# Altium project nRF52832_NanoDevKit.PrjPcb
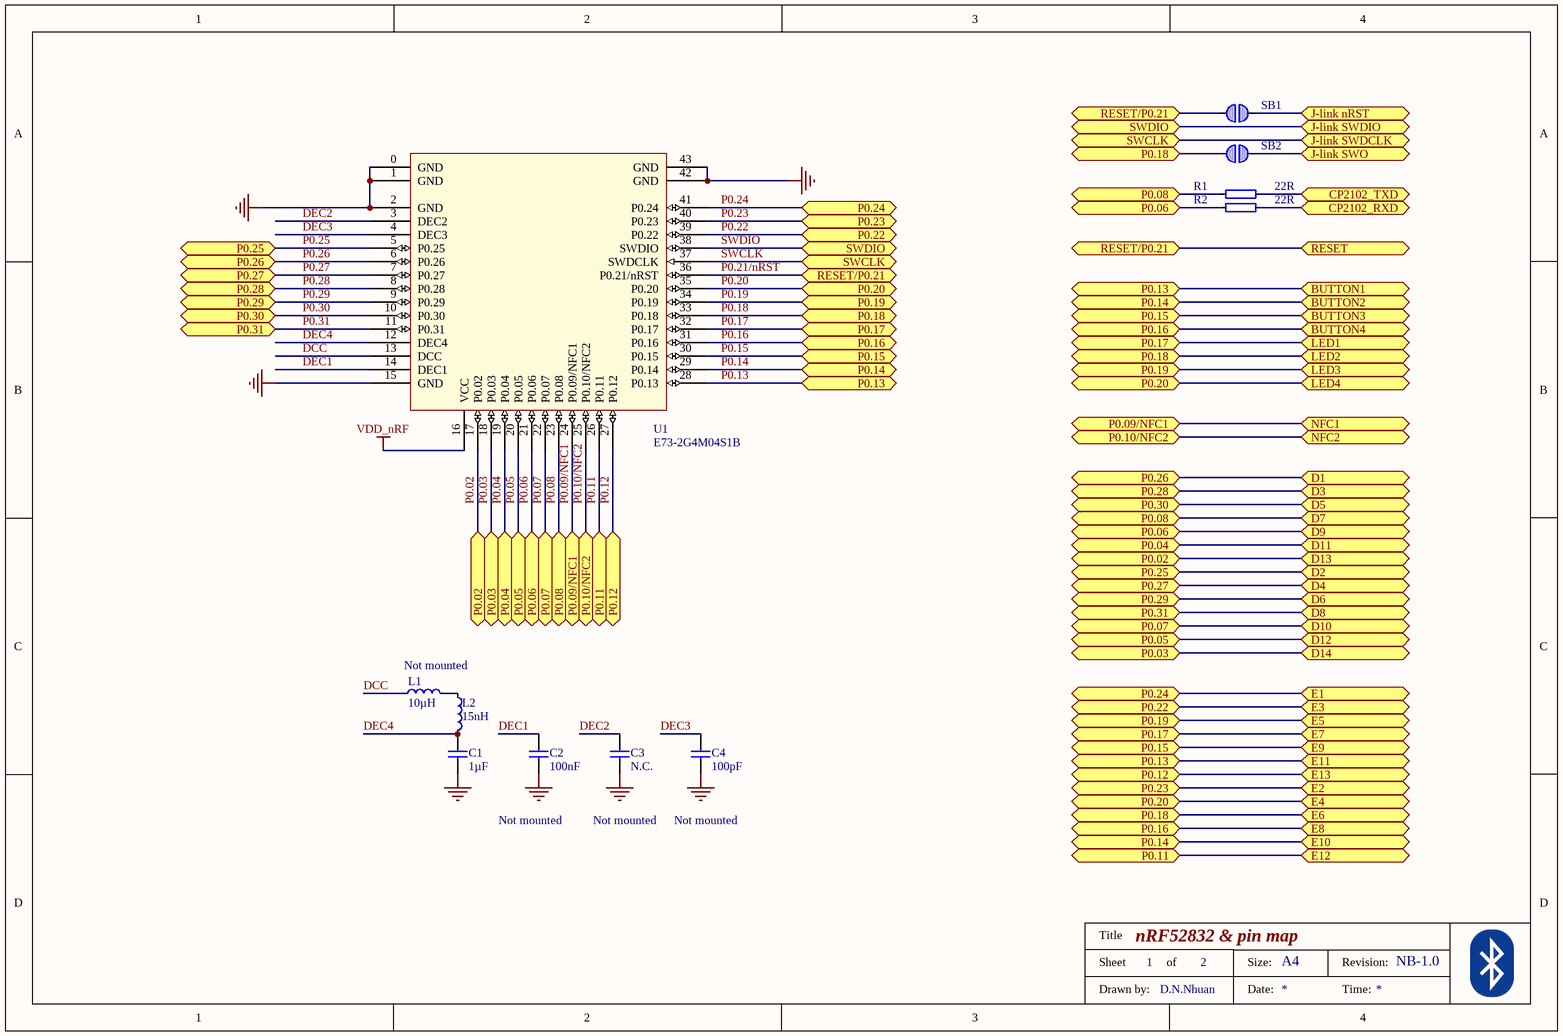
[diagram p0: nRF52832&pin_map.SchDoc]
2 sheets, 54 parts. Net scope: flat (ports and power ports of the same name join across sheets).
Board file: nRF52832_NanoDevKit.PcbDoc
Sheets:
  nRF52832&pin_map.SchDoc
  misc.SchDoc

## Sheet nRF52832&pin_map.SchDoc: nRF52832 & pin map
size A4; DrawnBy: D.N.Nhuan; DocumentNumber: 1; Revision: NB-1.0; SheetNumber: 1; SheetTotal: 2

### Parts
C1  1µF  [0603_Imperial]
C2  100nF  [0402 imperial]
C3  N.C.  [0402 imperial]
C4  100pF  [0402 imperial]
L1  10µH  [0603_Imperial]
L2  15nH  [0402 imperial]
R1  22R  [0402 imperial]
R2  22R  [0402 imperial]
SB1  Solderbridge  [Solderbridge]  (value not drawn)  (no BOM)
SB2  Solderbridge  [Solderbridge]  (value not drawn)  (no BOM)
U1  E73-2G4M04S1B  [nRF52832-Ebyte]

### Ports
BUTTON1, BUTTON2, BUTTON3, BUTTON4, CP2102_RXD, CP2102_TXD, D1, D2, D3, D4, D5, D6, D7, D8, D9, D10, D11, D12, D13, D14, E1, E2, E3, E4, E5, E6, E7, E8, E9, E10, E11, E12, E13, J-link nRST, J-link SWDCLK, J-link SWDIO, J-link SWO, LED1, LED2, LED3, LED4, NFC1, NFC2, P0.02, P0.03, P0.04, P0.05, P0.06, P0.07, P0.08, P0.09/NFC1, P0.10/NFC2, P0.11, P0.12, P0.13, P0.14, P0.15, P0.16, P0.17, P0.18, P0.19, P0.20, P0.22, P0.23, P0.24, P0.25, P0.26, P0.27, P0.28, P0.29, P0.30, P0.31, RESET, RESET/P0.21, SWCLK, SWDIO

### Nets
GND: C1.1 C2.1 C3.1 C4.1 U1.0(GND) U1.1(GND) U1.2(GND) U1.15(GND) U1.42(GND) U1.43(GND)
VDD_nRF: U1.16(VCC)
CP2102RXD: R2.2 ; port CP2102_RXD
CP2102TXD: R1.2 ; port CP2102_TXD
DCC: L1.1 U1.13(DCC)
DEC1: C2.2 U1.14(DEC1)
DEC2: C3.2 U1.3(DEC2)
DEC3: C4.2 U1.4(DEC3)
DEC4: C1.2 L2.2 U1.12(DEC4)
J-link nRST: SB1.1 ; port J-link nRST
J-link SWO: SB2.1 ; port J-link SWO
P0.02: U1.17(P0.02) ; port P0.02, port D13
P0.03: U1.18(P0.03) ; port P0.03, port D14
P0.04: U1.19(P0.04) ; port P0.04, port D11
P0.05: U1.20(P0.05) ; port P0.05, port D12
P0.06: R2.1 U1.21(P0.06) ; port P0.06, port D9
P0.07: U1.22(P0.07) ; port P0.07, port D10
P0.08: R1.1 U1.23(P0.08) ; port P0.08, port D7
P0.09/NFC1: U1.24(P0.09/NFC1) ; port P0.09/NFC1, port NFC1
P0.10/NFC2: U1.25(P0.10/NFC2) ; port P0.10/NFC2, port NFC2
P0.11: U1.26(P0.11) ; port E12, port P0.11
P0.12: U1.27(P0.12) ; port E13, port P0.12
P0.13: U1.28(P0.13) ; port P0.13, port BUTTON1, port E11
P0.14: U1.29(P0.14) ; port P0.14, port BUTTON2, port E10
P0.15: U1.30(P0.15) ; port P0.15, port BUTTON3, port E9
P0.16: U1.31(P0.16) ; port P0.16, port BUTTON4, port E8
P0.17: U1.32(P0.17) ; port P0.17, port LED1, port E7
P0.18: SB2.2 U1.33(P0.18) ; port P0.18, port LED2, port E6
P0.19: U1.34(P0.19) ; port P0.19, port LED3, port E5
P0.20: U1.35(P0.20) ; port P0.20, port LED4, port E4
P0.21/nRST: SB1.2 U1.36(P0.21/nRST) ; port RESET/P0.21, port RESET
P0.22: U1.39(P0.22) ; port P0.22, port E3
P0.23: U1.40(P0.23) ; port P0.23, port E2
P0.24: U1.41(P0.24) ; port P0.24, port E1
P0.25: U1.5(P0.25) ; port P0.25, port D2
P0.26: U1.6(P0.26) ; port P0.26, port D1
P0.27: U1.7(P0.27) ; port P0.27, port D4
P0.28: U1.8(P0.28) ; port P0.28, port D3
P0.29: U1.9(P0.29) ; port P0.29, port D6
P0.30: U1.10(P0.30) ; port P0.30, port D5
P0.31: U1.11(P0.31) ; port P0.31, port D8
SWCLK: U1.37(SWDCLK) ; port SWCLK, port J-link SWDCLK  [project net J-link SWCLK]
SWDIO: U1.38(SWDIO) ; port SWDIO, port J-link SWDIO  [project net J-link SWDIO]
NetL1_2: L1.2 L2.1

### Notes on the sheet
- Not mounted
- Title
- Sheet
- of
- Size:
- A4
- Revision:
- Drawn by:
- Date:
- Time:

### Library data of the parts
C1-C4 = Capacitor: common library; Tolerance: ±5%; Suppiler: *; Link of Supplier: *; Manufacturer: *; Manufacturer Part Number: *; Footprint: 0402
  C1: Value: 1µF
  C2: Value: 100nF
  C3: Value: N.C.
  C4: Value: 100pF
L1 L2 = Inductor: common library; Supplier: *; Link of Supplier: *; Maximum Current: *; Footprint: 0402
  L1: Value: 10µH
  L2: Value: 15nH
R1 R2 = Resistor: common library; Tolerance: ±5%; Value: 22R; Supplier: *; Link of Supplier: *; Footprint: 0402
SB1 SB2 = Solderbridge: Artikkelnr Noca: N.A.; Part Number: Solderbridge; Manufacturer: *; Manufacturer Part Number: *; Datasheet: *; LatestRevisionDate: 2009-12-14; Pin Count: 2; Publisher: Nordic Semiconductor; Published: 2009-12-14; Value: Solderbridge; Note: *; Supplier: *; Supplier part number: *; 2nd source Supplier: *; 2nd source part number: *; Footprint Doc: Solderbridge; Artikkelnr Simpro: N.A.
U1 = nRF52832-Ebyte: Ebyte E73-2G4M04S-52832; Part Number: E73-2G4M04S1B; Type: nRF52832 module; Manufacturer: EBYTE

## Sheet misc.SchDoc: Miscellaneous
size A4; DrawnBy: D.N.Nhuan; DocumentNumber: 2; Revision: NB-1.0; SheetNumber: 2; SheetTotal: 2
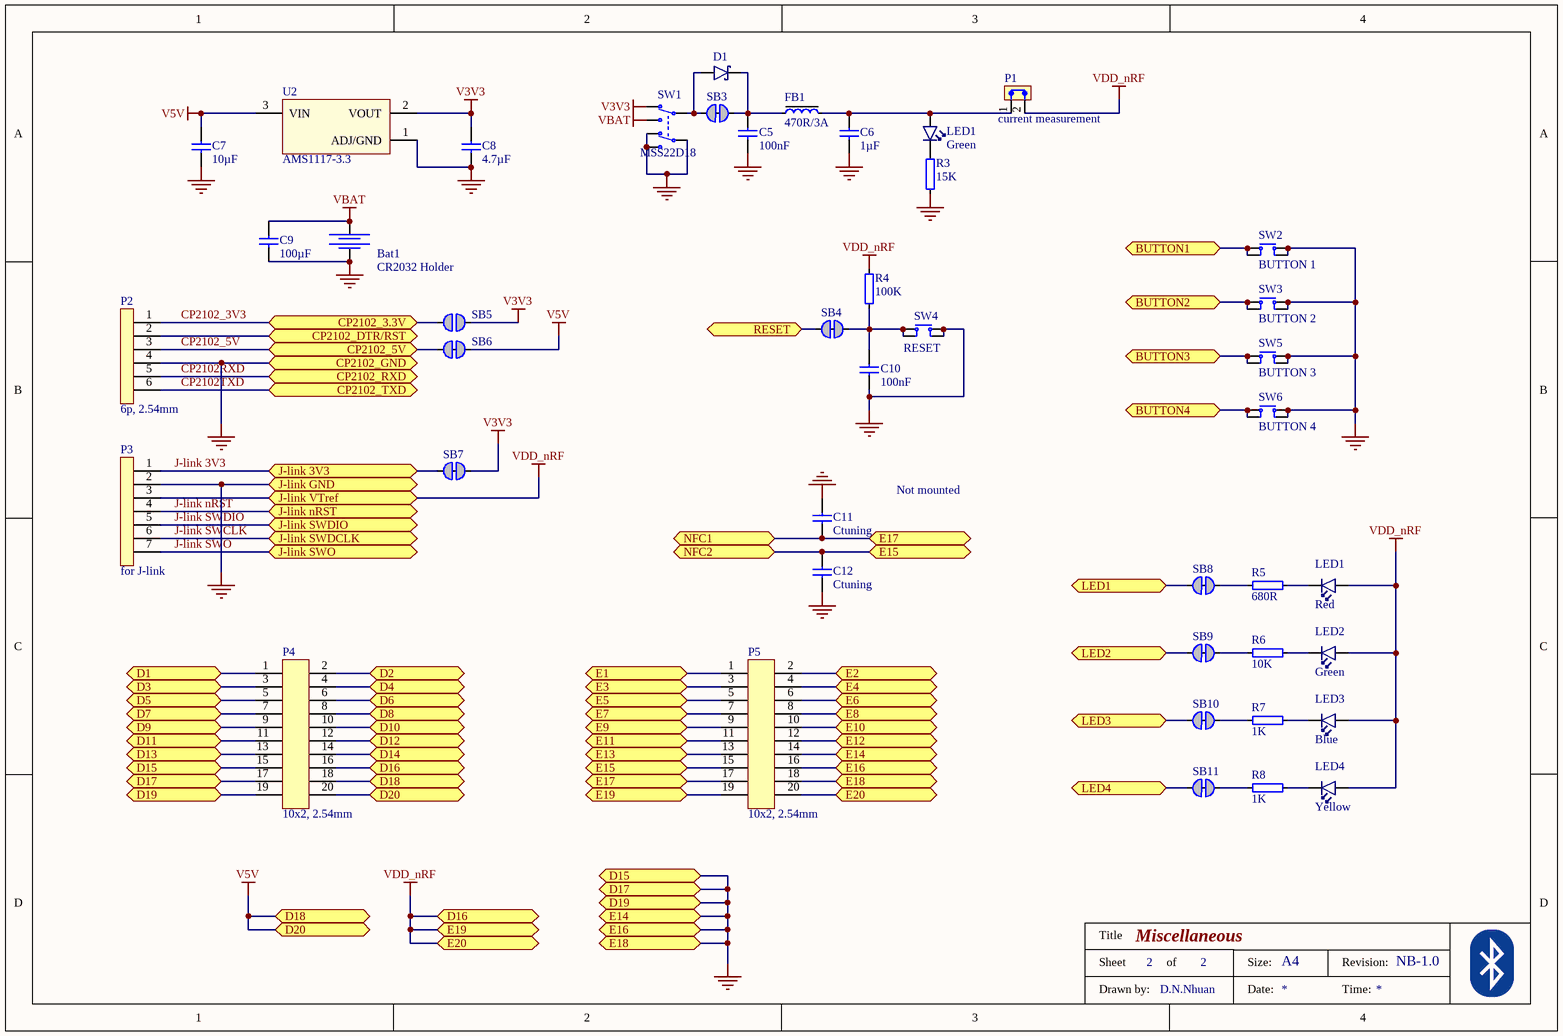
[diagram p1: misc.SchDoc]

### Parts
Bat1  CR2032 Holder  [CR2032_HOLDER]
C5  100nF  [0402 imperial]
C6  1µF  [0603_Imperial]
C7  10µF  [0805_Imperial]
C8  4.7µF  [0603_Imperial]
C9  100µF  [1210_Imperial]
C10  100nF  [0402 imperial]
C11  Ctuning  [0402 imperial]
C12  Ctuning  [0402 imperial]
D1  DIODE S4  [SOD-123]  (value not drawn)
FB1  470R/3A  [0603_Imperial]
LED1  Green  [LED_0603]
LED2  LED1  Color: Red  [LED_0603]
LED3  LED2  Color: Green  [LED_0603]
LED4  LED3  Color: Blue  [LED_0603]
LED5  LED4  Color: Yellow  [LED_0603]
P1  current measurement  [CONN2.54MM2P]
P2  6p, 2.54mm  [CONNX2.54MM6P]
P3  for J-link  [CONN2.54MM7P]
P4  10x2, 2.54mm  [CONN2.54MM10X2]
P5  10x2, 2.54mm  [CONN2.54MM10X2]
R3  15K  [0402 imperial]
R4  100K  [0402 imperial]
R5  680R  [0805_Imperial]
R6  10K  [0805_Imperial]
R7  1K  [0805_Imperial]
R8  1K  [0805_Imperial]
SB3  Solderbridge  [Solderbridge_Shorted]  (value not drawn)  (net tie, no BOM)
SB4  Solderbridge  [Solderbridge_Shorted]  (value not drawn)  (net tie, no BOM)
SB5  Solderbridge  [Solderbridge]  (value not drawn)  (no BOM)
SB6  Solderbridge  [Solderbridge_Shorted]  (value not drawn)  (net tie, no BOM)
SB7  Solderbridge  [Solderbridge_Shorted]  (value not drawn)  (net tie, no BOM)
SB8  Solderbridge  [Solderbridge_Shorted]  (value not drawn)  (net tie, no BOM)
SB9  Solderbridge  [Solderbridge_Shorted]  (value not drawn)  (net tie, no BOM)
SB10  Solderbridge  [Solderbridge_Shorted]  (value not drawn)  (net tie, no BOM)
SB11  Solderbridge  [Solderbridge_Shorted]  (value not drawn)  (net tie, no BOM)
SW1  MSS22D18  [MSS22D18SMD]
SW2  BUTTON 1  [Switch-PB-4.5x4.5mm-SMD]
SW3  BUTTON 2  [Switch-PB-4.5x4.5mm-SMD]
SW4  RESET  [Switch-PB-4.5x4.5mm-SMD]
SW5  BUTTON 3  [Switch-PB-4.5x4.5mm-SMD]
SW6  BUTTON 4  [Switch-PB-4.5x4.5mm-SMD]
U2  AMS1117-3.3  [SOT229P700X180-4N]

### Ports
BUTTON1, BUTTON2, BUTTON3, BUTTON4, CP2102_3.3V, CP2102_5V, CP2102_DTR/RST, CP2102_GND, CP2102_RXD, CP2102_TXD, D1, D2, D3, D4, D5, D6, D7, D8, D9, D10, D11, D12, D13, D14, D15, D16, D17, D18, D19, D20, E1, E2, E3, E4, E5, E6, E7, E8, E9, E10, E11, E12, E13, E14, E15, E16, E17, E18, E19, E20, J-link 3V3, J-link GND, J-link nRST, J-link SWDCLK, J-link SWDIO, J-link SWO, J-link VTref, LED1, LED2, LED3, LED4, NFC1, NFC2, RESET

### Nets
GND: Bat1.2 C5.1 C6.1 C7.1 C8.1 C9.1 C10.1 C11.2 C12.1 P2.4 P3.2 P4.15 P4.17 P4.19 P5.14 P5.16 P5.18 R3.1 SW1.4(N.O-2) SW1.5(COM-2) SW1.6(N.C-2) SW2.2(COM) SW2.4(COM) SW3.2(COM) SW3.4(COM) SW4.2(COM) SW4.4(COM) SW5.2(COM) SW5.4(COM) SW6.2(COM) SW6.4(COM) U2.1(ADJ/GND) ; port J-link GND, port D15, port D17, port D19, port CP2102_GND, port E14, port E16, port E18
V3V3: C8.2 SB5.1 SB7.1 SW1.3(N.C-1) U2.2(VOUT)
V5V: C7.2 P4.18 P4.20 SB6.1 U2.3(VIN) ; port D18, port D20
VBAT: Bat1.1 C9.2 SW1.1(N.O-1)
VDD_nRF: LED2.2(A) LED3.2(A) LED4.2(A) LED5.2(A) P1.2 P3.3 P4.16 P5.19 P5.20 R4.2 ; port J-link VTref, port D16, port E19, port E20
CP2102_3V3: P2.1 SB5.2 ; port CP2102_3.3V
CP2102_5V: P2.3 SB6.2 ; port CP2102_5V
CP2102RXD: P2.5 ; port CP2102_RXD
CP2102TXD: P2.6 ; port CP2102_TXD
J-link 3V3: P3.1 SB7.2 ; port J-link 3V3
J-link nRST: P3.4 ; port J-link nRST
J-link SWCLK: P3.6 ; port J-link SWDCLK
J-link SWDIO: P3.5 ; port J-link SWDIO
J-link SWO: P3.7 ; port J-link SWO
P0.02: P4.13 ; port D13
P0.03: P4.14 ; port D14
P0.04: P4.11 ; port D11
P0.05: P4.12 ; port D12
P0.06: P4.9 ; port D9
P0.07: P4.10 ; port D10
P0.08: P4.7 ; port D7
P0.09/NFC1: C11.1 P5.17 ; port NFC1, port E17
P0.10/NFC2: C12.2 P5.15 ; port NFC2, port E15
P0.11: P5.12 ; port E12
P0.12: P5.13 ; port E13
P0.13: P5.11 SW2.1(N.O) SW2.3(N.O) ; port BUTTON1, port E11
P0.14: P5.10 SW3.1(N.O) SW3.3(N.O) ; port BUTTON2, port E10
P0.15: P5.9 SW5.1(N.O) SW5.3(N.O) ; port BUTTON3, port E9
P0.16: P5.8 SW6.1(N.O) SW6.3(N.O) ; port BUTTON4, port E8
P0.17: P5.7 SB8.2 ; port LED1, port E7
P0.18: P5.6 SB9.2 ; port LED2, port E6
P0.19: P5.5 SB10.2 ; port LED3, port E5
P0.20: P5.4 SB11.2 ; port LED4, port E4
P0.21/nRST: SB4.2 ; port RESET
P0.22: P5.3 ; port E3
P0.23: P5.2 ; port E2
P0.24: P5.1 ; port E1
P0.25: P4.2 ; port D2
P0.26: P4.1 ; port D1
P0.27: P4.4 ; port D4
P0.28: P4.3 ; port D3
P0.29: P4.6 ; port D6
P0.30: P4.5 ; port D5
P0.31: P4.8 ; port D8
NetC5_2: C5.2 D1.1(C) FB1.1 SB3.1
NetC6_2: C6.2 FB1.2 LED1.2(A) P1.1
NetC10_2: C10.2 R4.1 SB4.1 SW4.1(N.O) SW4.3(N.O)
NetD1_2: D1.2(A) SB3.2 SW1.2(COM-1)
NetLED1_1: LED1.1(C) R3.2
NetLED2_1: LED2.1(C) R5.2
NetLED3_1: LED3.1(C) R6.2
NetLED4_1: LED4.1(C) R7.2
NetLED5_1: LED5.1(C) R8.2
NetP2_2: P2.2 ; port CP2102_DTR/RST
NetR5_1: R5.1 SB8.1
NetR6_1: R6.1 SB9.1
NetR7_1: R7.1 SB10.1
NetR8_1: R8.1 SB11.1

### Notes on the sheet
- Not mounted
- Title
- Sheet
- of
- Size:
- A4
- Revision:
- Drawn by:
- Date:
- Time:

### Library data of the parts
Bat1 = Bat Holder CR2032: Bat Holder CR2032 SMD; Note: CR2032 Holder
C5-C12 = Capacitor: common library; Tolerance: ±5%; Suppiler: *; Link of Supplier: *; Manufacturer: *; Manufacturer Part Number: *; Footprint: 0402
  C5 C10: Value: 100nF
  C6: Value: 1µF
  C7: Value: 10µF
  C8: Value: 4.7µF
  C9: Value: 100µF
  C11 C12: Value: Ctuning
D1 = Diode Schottky: common library; Value: DIODE S4; Note: *
FB1 = Ferrite Bead: common library; Footprint: 0603; Value: 470R/3A
LED1-LED5 = LED: common library; Footprint: 0603
  LED1: Color: Green
  LED2: Name: LED1
  LED3: Name: LED2
  LED4: Name: LED3
  LED5: Name: LED4
P1 = Headerx 2: common library; Value: current measurement
P2 = Header 6: common library; Value: 6p, 2.54mm
P3 = Header 7: common library; Value: for J-link
P4 P5 = Header 10x2: common library; Value: 10x2, 2.54mm
R3-R8 = Resistor: common library; Tolerance: ±5%; Supplier: *; Link of Supplier: *; Footprint: 0402
  R3: Value: 15K
  R4: Value: 100K
  R5: Value: 680R
  R6: Value: 10K
  R7 R8: Value: 1K
SB3 SB4 SB6-SB11 = Solderbridge Shorted: Shorted Solderbridge; Artikkelnr Noca: N.A.; Part Number: Solderbridge Shorted; Manufacturer: *; Manufacturer Part Number: *; Datasheet: *; LatestRevisionDate: 2012-08-07; Pin Count: 2; Publisher: Nordic Semiconductor; Published: 2012-08-07; Value: Solderbridge; Note: *; Supplier: *; Supplier part number: *; 2nd source Supplier: *; 2nd source part number: *; Footprint Doc: Solderbridge_Shorted; Artikkelnr Simpro: N.A.
SB5 = Solderbridge: Artikkelnr Noca: N.A.; Part Number: Solderbridge; Manufacturer: *; Manufacturer Part Number: *; Datasheet: *; LatestRevisionDate: 2009-12-14; Pin Count: 2; Publisher: Nordic Semiconductor; Published: 2009-12-14; Value: Solderbridge; Note: *; Supplier: *; Supplier part number: *; 2nd source Supplier: *; 2nd source part number: *; Footprint Doc: Solderbridge; Artikkelnr Simpro: N.A.
SW1 = Switch_DPDT: common library; Part Number: *; Manufacturer Part Number: *; Pin Count: 6; Value: MSS22D18; Note: *
SW2-SW6 = Push-Button: common library; Manufacturer: *; Manufacturer Part Number: *; Pin Count: 4; Note: *; Part Number: *
  SW2: Value: BUTTON 1
  SW3: Value: BUTTON 2
  SW4: Value: RESET
  SW5: Value: BUTTON 3
  SW6: Value: BUTTON 4
U2 = AMS1117: Low-dropout regulator; Type: AMS1117-3.3

## Nets that join several sheets
GND: nRF52832&pin_map (10 pins), misc (32 pins)
VDD_nRF: nRF52832&pin_map (U1.16), misc (10 pins)
CP2102RXD: nRF52832&pin_map (R2.2), misc (P2.5)
CP2102TXD: nRF52832&pin_map (R1.2), misc (P2.6)
J-link nRST: nRF52832&pin_map (SB1.1), misc (P3.4)
J-link SWCLK: nRF52832&pin_map (U1.37), misc (P3.6)
J-link SWDIO: nRF52832&pin_map (U1.38), misc (P3.5)
J-link SWO: nRF52832&pin_map (SB2.1), misc (P3.7)
P0.02: nRF52832&pin_map (U1.17), misc (P4.13)
P0.03: nRF52832&pin_map (U1.18), misc (P4.14)
P0.04: nRF52832&pin_map (U1.19), misc (P4.11)
P0.05: nRF52832&pin_map (U1.20), misc (P4.12)
P0.06: nRF52832&pin_map (R2.1 U1.21), misc (P4.9)
P0.07: nRF52832&pin_map (U1.22), misc (P4.10)
P0.08: nRF52832&pin_map (R1.1 U1.23), misc (P4.7)
P0.09/NFC1: nRF52832&pin_map (U1.24), misc (C11.1 P5.17)
P0.10/NFC2: nRF52832&pin_map (U1.25), misc (C12.2 P5.15)
P0.11: nRF52832&pin_map (U1.26), misc (P5.12)
P0.12: nRF52832&pin_map (U1.27), misc (P5.13)
P0.13: nRF52832&pin_map (U1.28), misc (P5.11 SW2.1 SW2.3)
P0.14: nRF52832&pin_map (U1.29), misc (P5.10 SW3.1 SW3.3)
P0.15: nRF52832&pin_map (U1.30), misc (P5.9 SW5.1 SW5.3)
P0.16: nRF52832&pin_map (U1.31), misc (P5.8 SW6.1 SW6.3)
P0.17: nRF52832&pin_map (U1.32), misc (P5.7 SB8.2)
P0.18: nRF52832&pin_map (SB2.2 U1.33), misc (P5.6 SB9.2)
P0.19: nRF52832&pin_map (U1.34), misc (P5.5 SB10.2)
P0.20: nRF52832&pin_map (U1.35), misc (P5.4 SB11.2)
P0.21/nRST: nRF52832&pin_map (SB1.2 U1.36), misc (SB4.2)
P0.22: nRF52832&pin_map (U1.39), misc (P5.3)
P0.23: nRF52832&pin_map (U1.40), misc (P5.2)
P0.24: nRF52832&pin_map (U1.41), misc (P5.1)
P0.25: nRF52832&pin_map (U1.5), misc (P4.2)
P0.26: nRF52832&pin_map (U1.6), misc (P4.1)
P0.27: nRF52832&pin_map (U1.7), misc (P4.4)
P0.28: nRF52832&pin_map (U1.8), misc (P4.3)
P0.29: nRF52832&pin_map (U1.9), misc (P4.6)
P0.30: nRF52832&pin_map (U1.10), misc (P4.5)
P0.31: nRF52832&pin_map (U1.11), misc (P4.8)